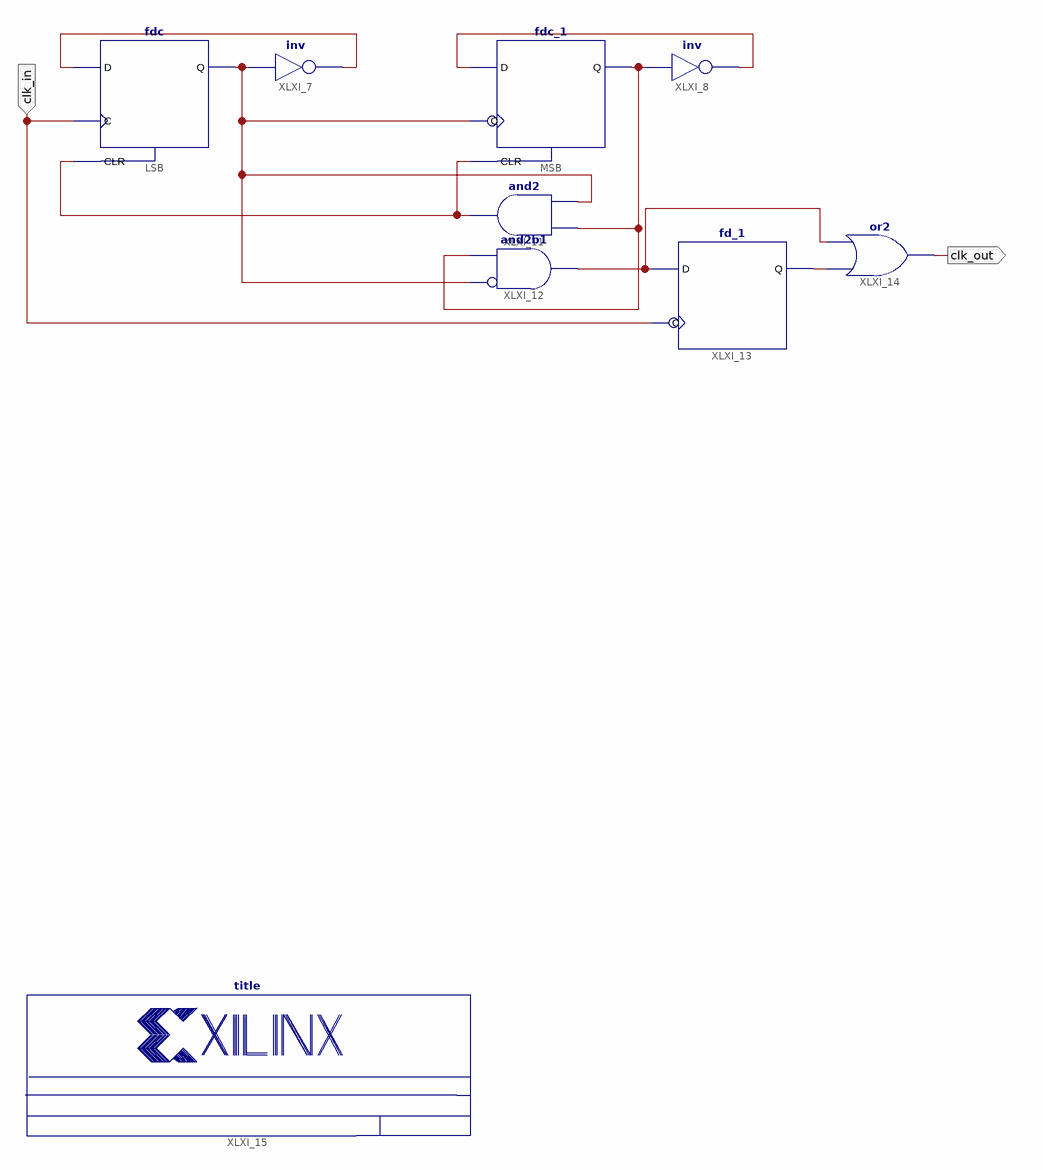
[diagram p0: schematic sheet 1]
// Xilinx ISE schematic CLKDIV_3_50.sch (spartan3e) as structural Verilog: 9 symbols, 2 ports
module CLKDIV_3_50 (
  input  clk_in,
  output clk_out
);

  wire XLXN_8, XLXN_10, XLXN_11, XLXN_19, XLXN_21, XLXN_23, XLXN_25;

  fdc LSB (.C(clk_in), .CLR(XLXN_19), .D(XLXN_8), .Q(XLXN_11));
  not XLXI_7 (XLXN_8, XLXN_11);
  not XLXI_8 (XLXN_10, XLXN_21);
  fdc_1 MSB (.C(XLXN_11), .CLR(XLXN_19), .D(XLXN_10), .Q(XLXN_21));
  and XLXI_11 (XLXN_19, XLXN_11, XLXN_21);
  and XLXI_12 (XLXN_23, ~XLXN_11, XLXN_21);  // and2b1
  fd_1 XLXI_13 (.C(clk_in), .D(XLXN_23), .Q(XLXN_25));
  or XLXI_14 (clk_out, XLXN_25, XLXN_23);
  title #(.TitleFieldText("Karthik Vippala")) XLXI_15 ();
endmodule
